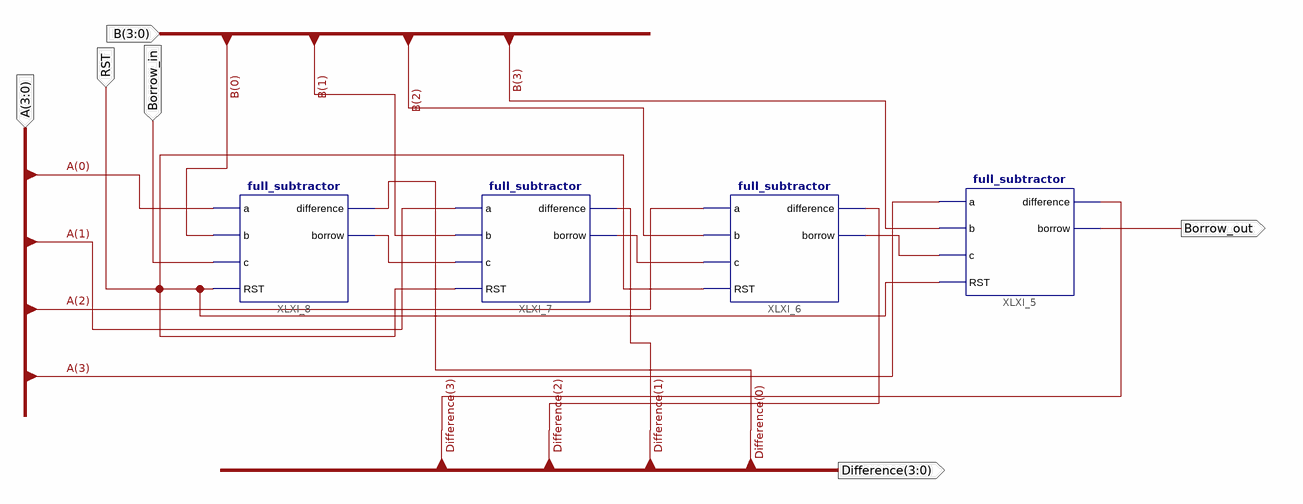
[diagram p0: schematic sheet 1]
// Xilinx ISE schematic full_subtractor4.sch (artix7) as structural Verilog: 4 symbols, 6 ports
module full_subtractor4 (
  input  [3:0] A,
  input  [3:0] B,
  input  Borrow_in,
  input  RST,
  output [3:0] Difference,
  output Borrow_out
);

  wire XLXN_16, XLXN_17, XLXN_18;

  full_subtractor XLXI_5 (.a(A[3]), .b(B[3]), .borrow(Borrow_out), .c(XLXN_18), .difference(Difference[3]), .RST(RST));
  full_subtractor XLXI_6 (.a(A[2]), .b(B[2]), .borrow(XLXN_18), .c(XLXN_17), .difference(Difference[2]), .RST(RST));
  full_subtractor XLXI_7 (.a(A[1]), .b(B[1]), .borrow(XLXN_17), .c(XLXN_16), .difference(Difference[1]), .RST(RST));
  full_subtractor XLXI_8 (.a(A[0]), .b(B[0]), .borrow(XLXN_16), .c(Borrow_in), .difference(Difference[0]), .RST(RST));
endmodule
